# EAGLE design untitled (EAGLE 9.4.2)
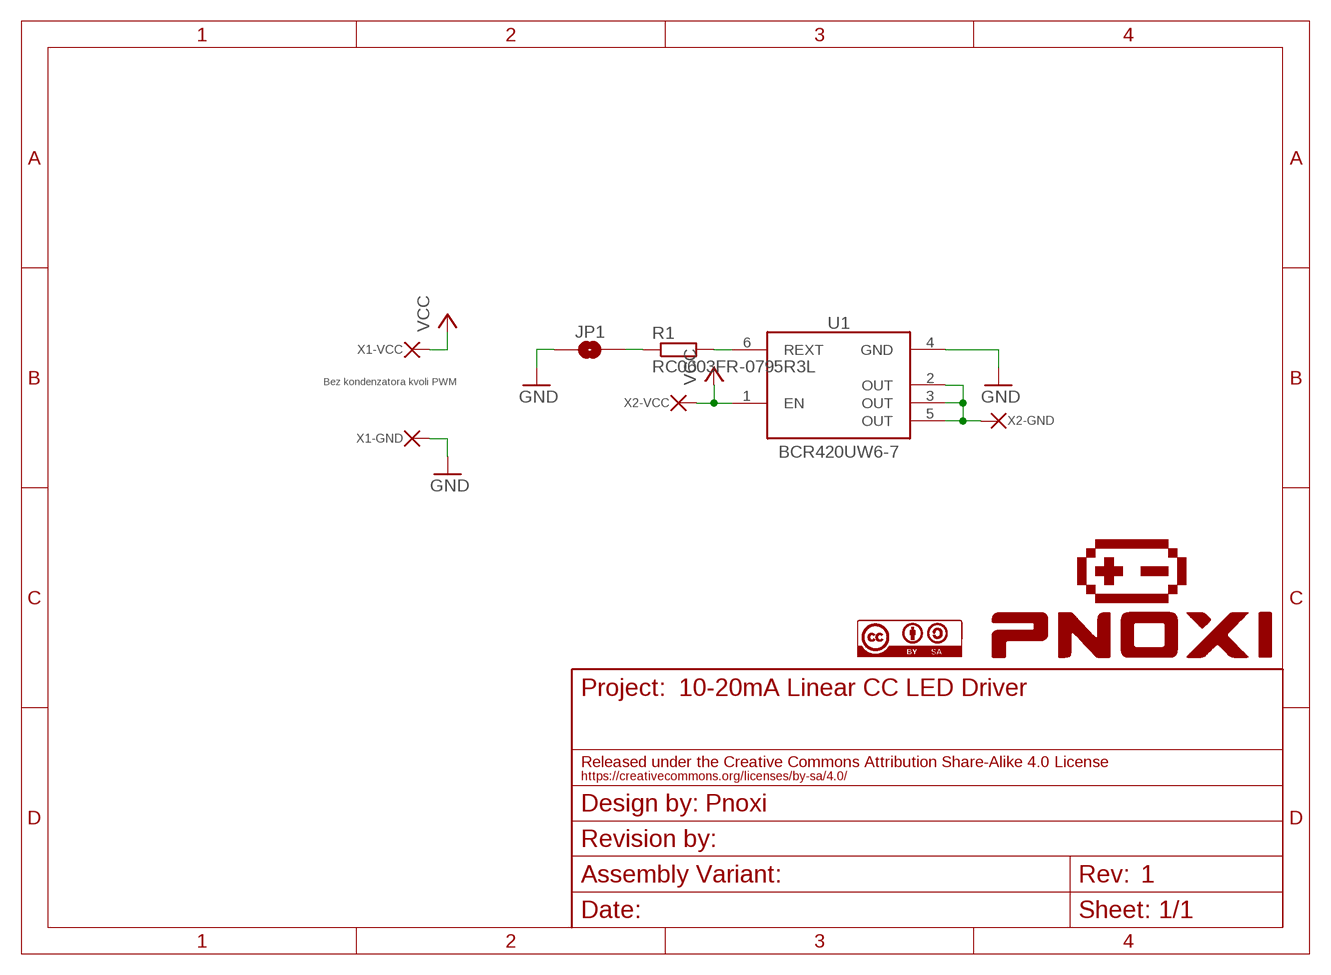
[diagram p0: schematic, sheet 1]
QUIT1 (A5L): DESIGNER: Pnoxi; PROJECT_NAME: 10-20mA Linear CC LED Driver; REV: 1

## Parts
JP1  SMD-JUMPER-2-NO  [SMD-JUMPER-2-NO]
R1  RC0603FR-0795R3L  R_EU_0603  [0603]
U1  BCR420UW6-7  BCR420U_NO_THERMALS  [SOP95P250X110-6N-1_NO_THERMALS]
X1  SMD_PAD2  [SMD_PAD_2]
X2  SMD_PAD2  [SMD_PAD_2]

## Nets
GND: JP1.P$1 U1.4(GND) X1.GND X1.GND1 X1.GND2 X1.GND3
N$1: JP1.P$2 R1.1
N$2: R1.2 U1.6(REXT)
N$4: U1.2(OUT) U1.3(OUT) U1.5(OUT) X2.GND X2.GND1 X2.GND2 X2.GND3
VCC: U1.1(EN) X1.VCC X1.VCC1 X1.VCC2 X1.VCC3 X2.VCC X2.VCC1 X2.VCC2 X2.VCC3

## Notes on the sheet
- Bez kondenzatora kvoli PWM

## Library data of the parts
JP1 = Emsit-Passives:SMD-JUMPER-2-NO
R1 = Emsit-Passives:R_EU
U1 = Emsit-AnalogIC:BCR420U_
X1 X2 = CC_driver_5mm_LED:SMD_PAD

## Net classes
0 default: clearance 0.205 mm

## Board
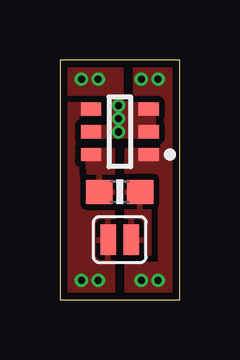
[diagram p1: board, top side]
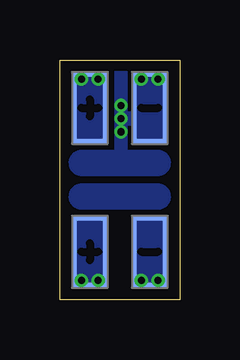
[diagram p2: board, bottom side, seen from below]

Size 5 x 10 mm. Coordinates in mm from the lower left corner, seen from the top.
Outline: 0,0 5,0 5,10 0,10 0,0
Copper layers (1*16): Top 0.035559375mm / dielectric 1.6mm / Bottom 0.035559375mm
Design rules "oshpark-2layer *": minimum track width 6mil, minimum drill 10mil, track to track 6mil, track to pad 6mil, pad to pad 6mil, via to via 6mil, smd to smd 6mil, copper to edge 12mil, drill to drill 6mil, minimum pad ring 5mil, minimum via ring 5mil, stop-mask expansion 2.5mil, vias tented up to drill 0.5mm, thermal gap 8mil

### Footprints (pad centres in the part's own frame; a part is rotated, then mirrored left to right if it is on the bottom)
SMD-JUMPER-2-NO = smd 0.635 x 1.27: P$1 -0.483,0; P$2 0.483,0
0603 = smd 1.1 x 1: 1 -0.85,0; 2 0.85,0
SOP95P250X110-6N-1_NO_THERMALS = smd 0.85 x 0.55: 1 -1.2,0.95; 2 -1.2,0; 3 -1.2,-0.95; 4 1.2,-0.95; 5 1.2,0; 6 1.2,0.95
SMD_PAD_2 = smd 1.5 x 0.2 bottom: GND -1.25,-1.4; GND2 -1.25,1.4; VCC 1.25,-1.4; VCC2 1.25,1.4 | smd 0.2 x 2.6 bottom: GND1 -0.6,0; GND3 -1.9,0; VCC1 1.9,0; VCC3 0.6,0

### Placement (x,y rotation side)
JP1  2.5,2.5 0 top
R1  2.5,4.5 180 top
U1  2.5,7 180 top
X1  2.5,2 0 top
X2  2.5,8 0 top

### Tracks (layer width: path | path; a pad name or v marks a point on that pad's centre or on a via)
GND  (via drill 0.3)
  other vias: 1.6,0.8 0.9,0.8
  pour Bottom (isolate 0.102, no thermals): 0.5,3.5 2,3.5 2,0.5 0.5,0.5
  pour Top (isolate 0.254): 0,0 0,8.15 1.5,8.15 1.5,7.75 0.7,7.75 0.7,5.1 0.8,5.1 0.8,3.7 2.2,3.7 2.2,0
N$1
  pour Top (isolate 0.254, rank 6): 2.8,1.9 2.8,4.9 3.8,4.9 3.8,1.9
N$2
  pour Top (isolate 0.254, rank 6): 1.1,6.25 2.2,6.25 2.2,4 1.1,4
N$3
  pour Bottom (isolate 0.102, rank 6, no thermals): 4.1,4.8 arc-180 4.1,3.8 0.9,3.8 arc-180 0.9,4.8
N$4  (via drill 0.3)
  other vias: 1.6,9.2 0.9,9.2 2.45,8.1 2.45,7.55 2.45,7
  pour Top (isolate 0.254, rank 6): 3.9,8.2 3.9,6.8 1.1,6.8 1.1,7.2 2.1,7.2 2.1,8.6 0,8.6 0,10 2.55,10 2.55,8.2
  pour Bottom (isolate 0.102, no thermals): 4.1,6.2 arc-180 4.1,5.2 0.9,5.2 arc-180 0.9,6.2 2.2,6.2 2.2,7.3 2,7.3 2,6.5 0.5,6.5 0.5,9.5 2,9.5 2,7.8 2.2,7.8 2.2,9.5 2.7,9.5 2.7,6.2
VCC  (via drill 0.3)
  other vias: 4.1,0.8 3.4,0.8 3.4,9.2 4.1,9.2
  pour Bottom (isolate 0.102, no thermals): 3,9.5 4.5,9.5 4.5,6.5 3,6.5
  pour Bottom (isolate 0.102, no thermals): 3,3.5 4.5,3.5 4.5,0.5 3,0.5
  pour Top (isolate 0.254): 5,0 2.8,0 2.8,1.5 4.2,1.5 4.2,5.3 2.8,5.3 2.8,6.25 4.3,6.25 4.3,8.6 3.15,8.6 3.15,10 5,10

### Text on the board
tStop: 20mA
bStop: +LED- | +INPUT-